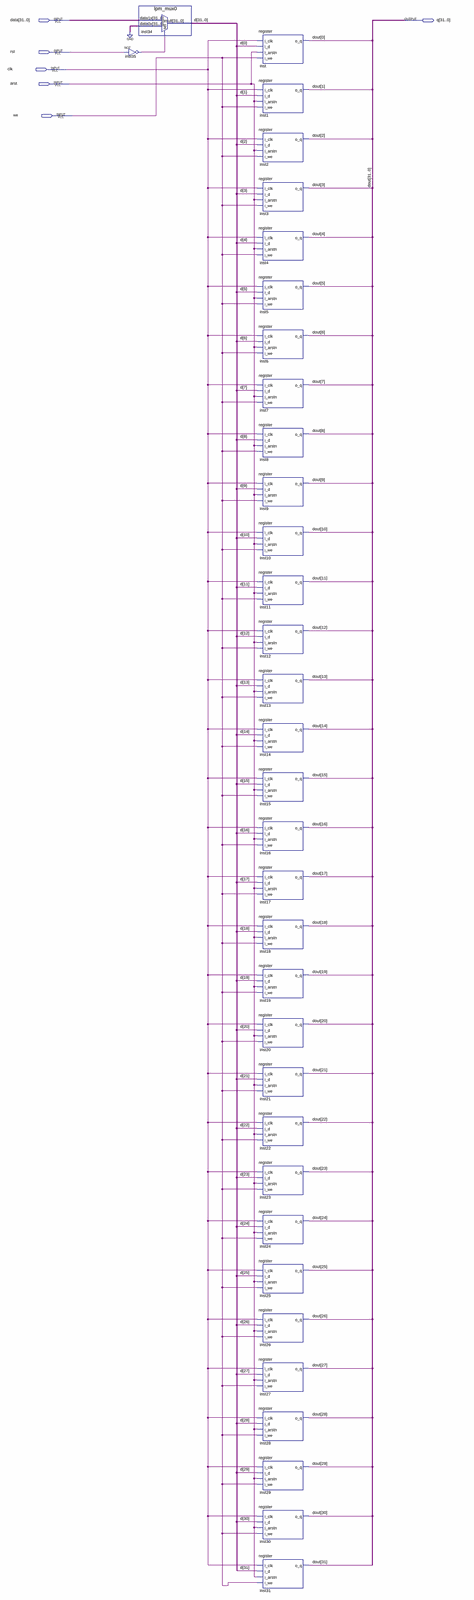
[diagram p0: schematic sheet, whole]
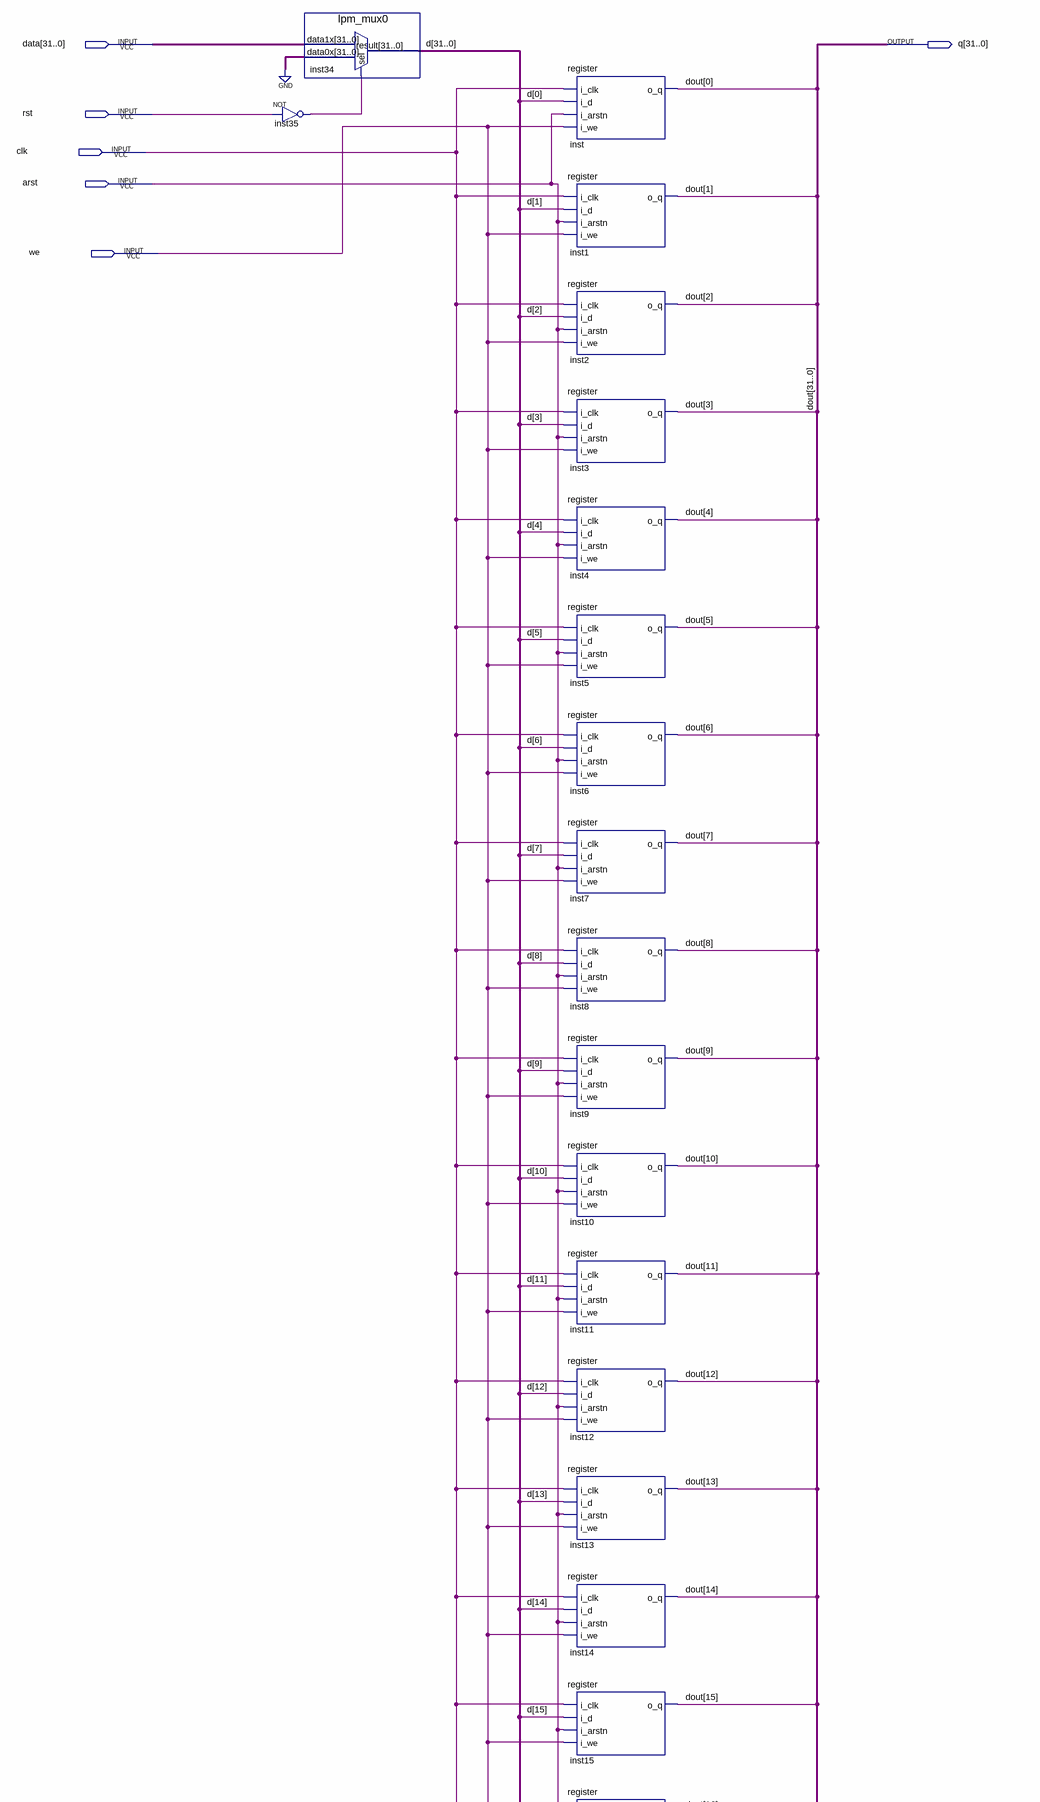
[diagram p1: schematic sheet, upper part]
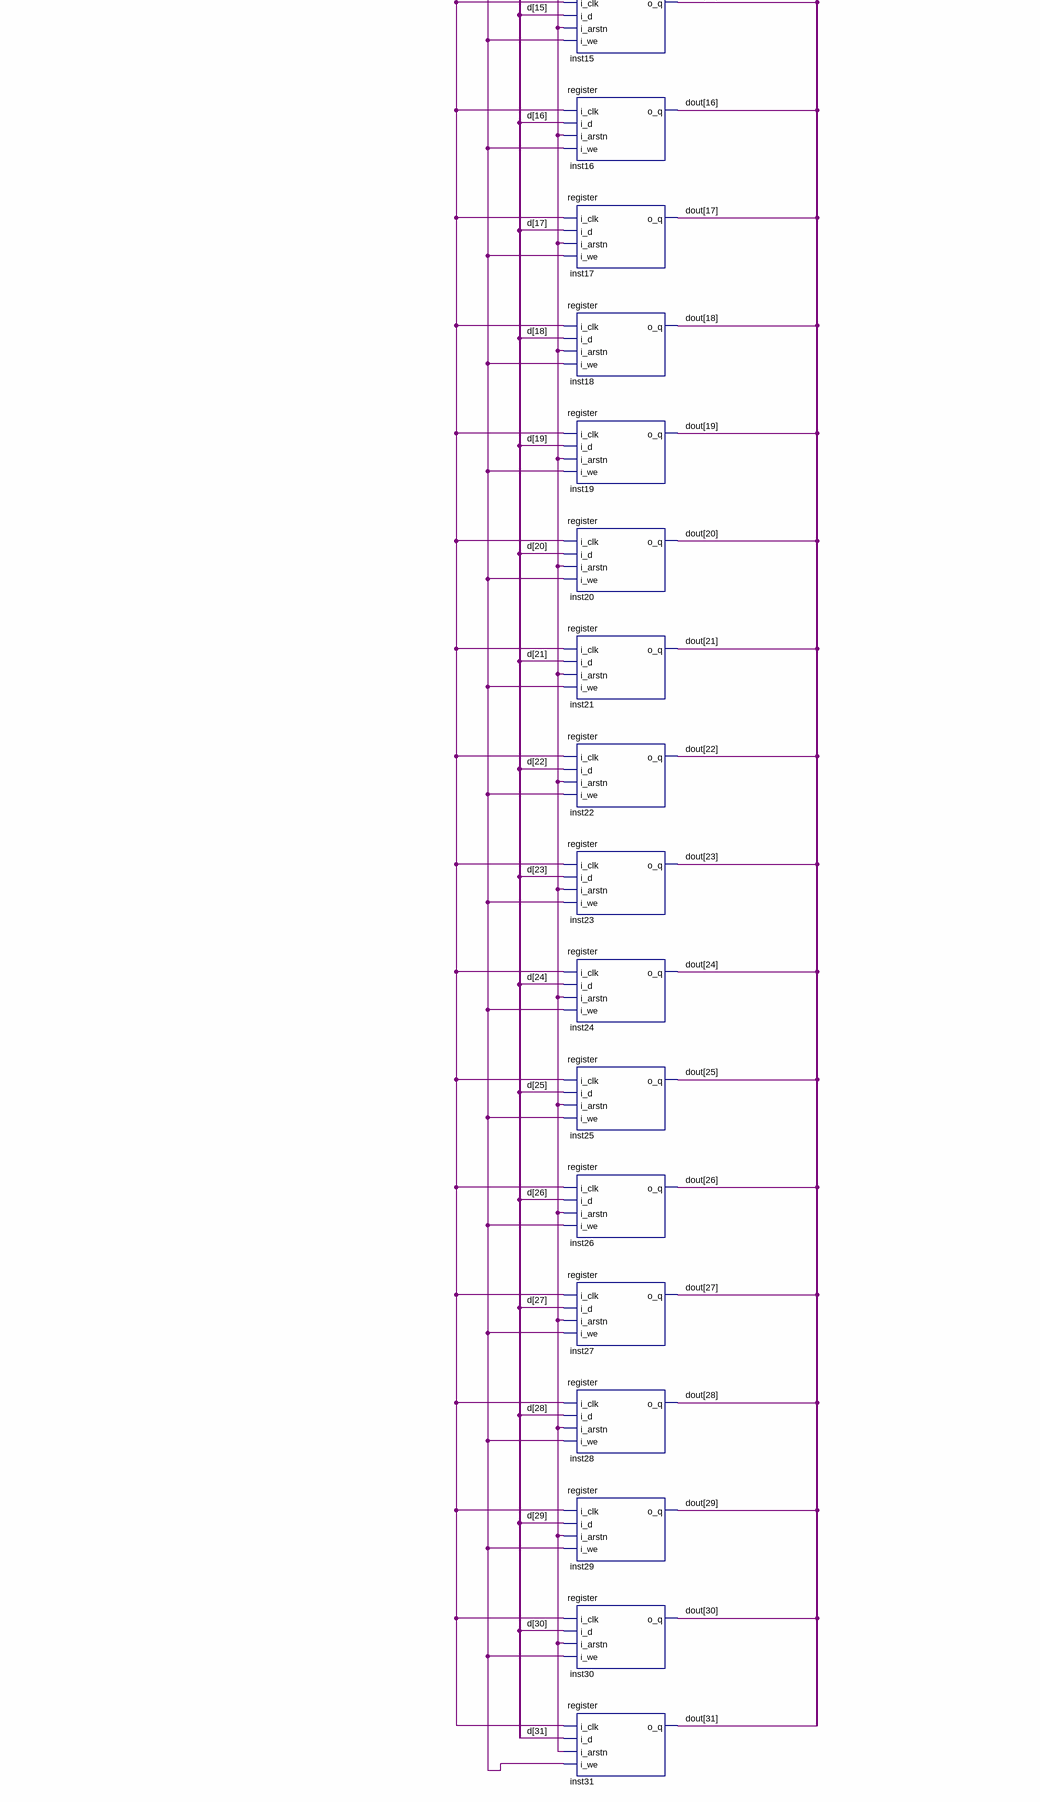
[diagram p2: schematic sheet, lower part]
// Quartus schematic lab1.bdf as structural Verilog: 34 symbols, 6 pins
module lab1 (
  input  [31:0] data,
  input  rst,
  input  clk,
  input  arst,
  input  we,
  output [31:0] q
);

  wire inst35_out;
  wire [31:0] d;

  lpm_mux0 inst34 (.data1x(data), .data0x({32{1'b0}}), .sel(inst35_out), .result(d));
  not inst35 (inst35_out, rst);
  register inst (.i_clk(clk), .i_d(d[0]), .i_arstn(arst), .i_we(we), .o_q(q[0]));
  register inst1 (.i_clk(clk), .i_d(d[1]), .i_arstn(arst), .i_we(we), .o_q(q[1]));
  register inst2 (.i_clk(clk), .i_d(d[2]), .i_arstn(arst), .i_we(we), .o_q(q[2]));
  register inst3 (.i_clk(clk), .i_d(d[3]), .i_arstn(arst), .i_we(we), .o_q(q[3]));
  register inst4 (.i_clk(clk), .i_d(d[4]), .i_arstn(arst), .i_we(we), .o_q(q[4]));
  register inst5 (.i_clk(clk), .i_d(d[5]), .i_arstn(arst), .i_we(we), .o_q(q[5]));
  register inst6 (.i_clk(clk), .i_d(d[6]), .i_arstn(arst), .i_we(we), .o_q(q[6]));
  register inst7 (.i_clk(clk), .i_d(d[7]), .i_arstn(arst), .i_we(we), .o_q(q[7]));
  register inst8 (.i_clk(clk), .i_d(d[8]), .i_arstn(arst), .i_we(we), .o_q(q[8]));
  register inst9 (.i_clk(clk), .i_d(d[9]), .i_arstn(arst), .i_we(we), .o_q(q[9]));
  register inst10 (.i_clk(clk), .i_d(d[10]), .i_arstn(arst), .i_we(we), .o_q(q[10]));
  register inst11 (.i_clk(clk), .i_d(d[11]), .i_arstn(arst), .i_we(we), .o_q(q[11]));
  register inst12 (.i_clk(clk), .i_d(d[12]), .i_arstn(arst), .i_we(we), .o_q(q[12]));
  register inst13 (.i_clk(clk), .i_d(d[13]), .i_arstn(arst), .i_we(we), .o_q(q[13]));
  register inst14 (.i_clk(clk), .i_d(d[14]), .i_arstn(arst), .i_we(we), .o_q(q[14]));
  register inst15 (.i_clk(clk), .i_d(d[15]), .i_arstn(arst), .i_we(we), .o_q(q[15]));
  register inst16 (.i_clk(clk), .i_d(d[16]), .i_arstn(arst), .i_we(we), .o_q(q[16]));
  register inst17 (.i_clk(clk), .i_d(d[17]), .i_arstn(arst), .i_we(we), .o_q(q[17]));
  register inst18 (.i_clk(clk), .i_d(d[18]), .i_arstn(arst), .i_we(we), .o_q(q[18]));
  register inst19 (.i_clk(clk), .i_d(d[19]), .i_arstn(arst), .i_we(we), .o_q(q[19]));
  register inst20 (.i_clk(clk), .i_d(d[20]), .i_arstn(arst), .i_we(we), .o_q(q[20]));
  register inst21 (.i_clk(clk), .i_d(d[21]), .i_arstn(arst), .i_we(we), .o_q(q[21]));
  register inst22 (.i_clk(clk), .i_d(d[22]), .i_arstn(arst), .i_we(we), .o_q(q[22]));
  register inst23 (.i_clk(clk), .i_d(d[23]), .i_arstn(arst), .i_we(we), .o_q(q[23]));
  register inst24 (.i_clk(clk), .i_d(d[24]), .i_arstn(arst), .i_we(we), .o_q(q[24]));
  register inst25 (.i_clk(clk), .i_d(d[25]), .i_arstn(arst), .i_we(we), .o_q(q[25]));
  register inst26 (.i_clk(clk), .i_d(d[26]), .i_arstn(arst), .i_we(we), .o_q(q[26]));
  register inst27 (.i_clk(clk), .i_d(d[27]), .i_arstn(arst), .i_we(we), .o_q(q[27]));
  register inst28 (.i_clk(clk), .i_d(d[28]), .i_arstn(arst), .i_we(we), .o_q(q[28]));
  register inst29 (.i_clk(clk), .i_d(d[29]), .i_arstn(arst), .i_we(we), .o_q(q[29]));
  register inst30 (.i_clk(clk), .i_d(d[30]), .i_arstn(arst), .i_we(we), .o_q(q[30]));
  register inst31 (.i_clk(clk), .i_d(d[31]), .i_arstn(arst), .i_we(we), .o_q(q[31]));

  // Other names for the same wires on the sheet: dout[31:0] = q
endmodule
